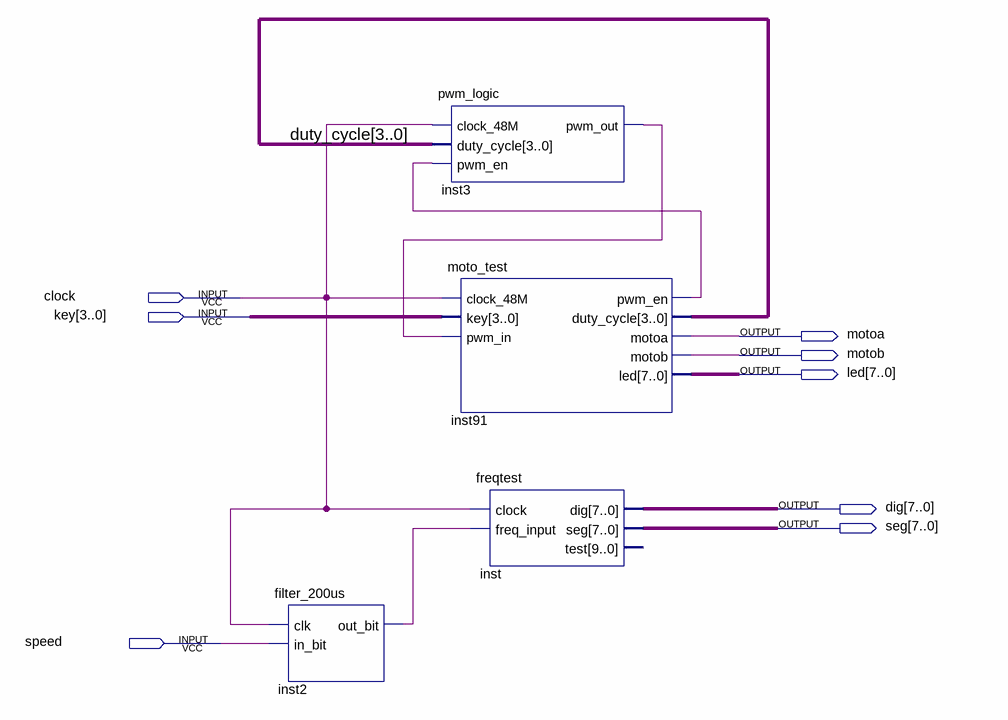
[diagram p0: schematic sheet]
// Quartus schematic motor.bdf as structural Verilog: 4 symbols, 8 pins
module motor (
  input  clock,
  input  [3:0] key,
  input  speed,
  output motoa,
  output motob,
  output [7:0] led,
  output [7:0] dig,
  output [7:0] seg
);

  wire inst2_out_bit, inst3_pwm_out, inst91_pwm_en;
  wire [3:0] duty_cycle;

  filter_200us inst2 (.clk(clock), .in_bit(speed), .out_bit(inst2_out_bit));
  pwm_logic inst3 (.clock_48M(clock), .duty_cycle(duty_cycle), .pwm_en(inst91_pwm_en), .pwm_out(inst3_pwm_out));
  moto_test inst91 (
    .clock_48M(clock), .key(key), .pwm_in(inst3_pwm_out), .pwm_en(inst91_pwm_en), .duty_cycle(duty_cycle),
    .motoa(motoa), .motob(motob), .led(led));
  freqtest inst (.clock(clock), .freq_input(inst2_out_bit), .dig(dig), .seg(seg));  // open: test
endmodule
